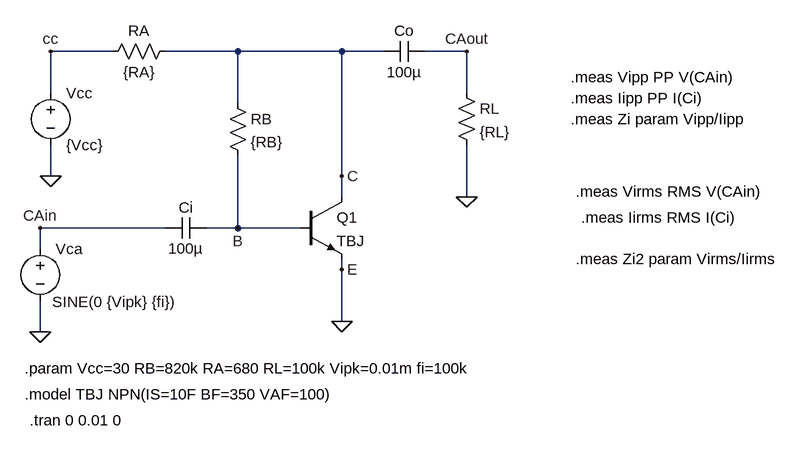
[diagram p0: schematic TBJ04CAZi.asc]
TBJ04CAZi.asc, the LTspice schematic file:
Version 4
SHEET 1 1608 1200
WIRE -64 -16 -160 -16
WIRE 128 -16 16 -16
WIRE 288 -16 128 -16
WIRE 352 -16 288 -16
WIRE 480 -16 416 -16
WIRE -160 48 -160 -16
WIRE 480 48 480 -16
WIRE 128 64 128 -16
WIRE -160 176 -160 128
WIRE 288 176 288 -16
WIRE 288 208 288 176
WIRE 480 208 480 128
WIRE 16 256 -176 256
WIRE 128 256 128 144
WIRE 128 256 80 256
WIRE 224 256 128 256
WIRE -176 288 -176 256
WIRE 288 320 288 304
WIRE 288 400 288 320
WIRE -176 416 -176 368
FLAG -160 176 0
FLAG 288 400 0
FLAG -176 416 0
FLAG -176 256 CAin
FLAG 480 208 0
FLAG 480 -16 CAout
FLAG 128 256 B
FLAG 288 176 C
FLAG 288 320 E
FLAG -160 -16 cc
SYMBOL res 112 48 R0
SYMATTR InstName RB
SYMATTR Value {RB}
SYMBOL voltage -160 32 R0
WINDOW 123 0 0 Left 0
WINDOW 39 0 0 Left 0
SYMATTR InstName Vcc
SYMATTR Value {Vcc}
SYMBOL npn 224 208 R0
SYMATTR InstName Q1
SYMATTR Value TBJ
SYMBOL cap 80 240 R90
WINDOW 0 0 32 VBottom 2
WINDOW 3 32 32 VTop 2
SYMATTR InstName Ci
SYMATTR Value 100µ
SYMBOL cap 416 -32 R90
WINDOW 0 0 32 VBottom 2
WINDOW 3 32 32 VTop 2
SYMATTR InstName Co
SYMATTR Value 100µ
SYMBOL voltage -176 272 R0
WINDOW 123 0 0 Left 0
WINDOW 39 0 0 Left 0
WINDOW 3 18 98 Left 2
SYMATTR Value SINE(0 {Vipk} {fi})
SYMATTR InstName Vca
SYMBOL res 464 32 R0
SYMATTR InstName RL
SYMATTR Value {RL}
SYMBOL res 32 -32 R90
WINDOW 0 0 56 VBottom 2
WINDOW 3 32 56 VTop 2
SYMATTR InstName RA
SYMATTR Value {RA}
TEXT -200 472 Left 2 !.param Vcc=30 RB=820k RA=680 RL=100k Vipk=0.01m fi=100k
TEXT -200 512 Left 2 !.model TBJ NPN(IS=10F BF=350 VAF=100)
TEXT 640 24 Left 2 !.meas Vipp PP V(CAin)
TEXT 640 56 Left 2 !.meas Iipp PP I(Ci)
TEXT 640 88 Left 2 !.meas Zi param Vipp/Iipp
TEXT -192 552 Left 2 !.tran 0 0.01 0
TEXT 648 200 Left 2 !.meas Virms RMS V(CAin)
TEXT 656 240 Left 2 !.meas Iirms RMS I(Ci)
TEXT 648 304 Left 2 !.meas Zi2 param Virms/Iirms

The netlist it stands for:
* TBJ04CAZi.asc
RB C B {RB}
Vcc cc 0 {Vcc}
Q1 C B 0 0 TBJ
Ci B CAin 100µ
Co CAout C 100µ
Vca CAin 0 SINE(0 {Vipk} {fi})
RL CAout 0 {RL}
RA C cc {RA}
.model NPN NPN
.model PNP PNP
.lib standard.bjt
.param Vcc=30 RB=820k RA=680 RL=100k Vipk=0.01m fi=100k
.model TBJ NPN(IS=10F BF=350 VAF=100)
.meas Vipp PP V(CAin)
.meas Iipp PP I(Ci)
.meas Zi param Vipp/Iipp
.tran 0 0.01 0
.meas Virms RMS V(CAin)
.meas Iirms RMS I(Ci)
.meas Zi2 param Virms/Iirms
.backanno
.end